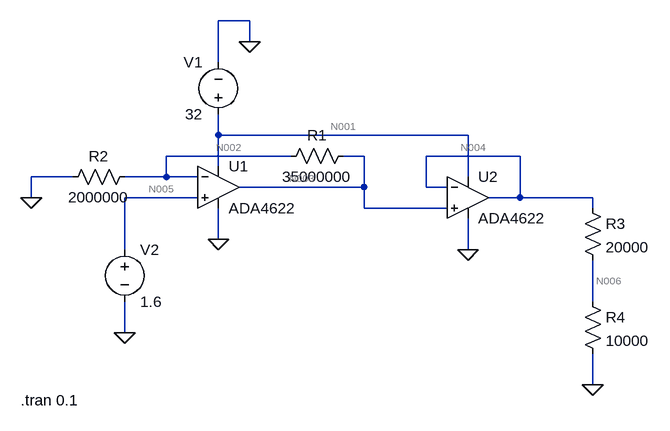
[diagram p0: schematic Ohmmeter_Circuit_1p0.asc]
Ohmmeter_Circuit_1p0.asc, the LTspice schematic file:
Version 4.1
SHEET 1 880 680
WIRE 192 -96 144 -96
WIRE 192 -64 192 -96
WIRE 144 -32 144 -96
WIRE 144 80 144 48
WIRE 528 80 144 80
WIRE 256 112 64 112
WIRE 368 112 336 112
WIRE 608 112 464 112
WIRE 144 128 144 80
WIRE -80 144 -144 144
WIRE 64 144 64 112
WIRE 64 144 0 144
WIRE 112 144 64 144
WIRE 528 144 528 80
WIRE 368 160 368 112
WIRE 368 160 176 160
WIRE 464 160 464 112
WIRE 496 160 464 160
WIRE -144 176 -144 144
WIRE 112 176 0 176
WIRE 608 176 608 112
WIRE 608 176 560 176
WIRE 720 176 608 176
WIRE 368 192 368 160
WIRE 496 192 368 192
WIRE 720 192 720 176
WIRE 144 240 144 192
WIRE 0 256 0 176
WIRE 528 256 528 208
WIRE 720 336 720 272
WIRE 0 384 0 336
WIRE 720 464 720 416
FLAG 144 240 0
FLAG 528 256 0
FLAG 192 -64 0
FLAG -144 176 0
FLAG 0 384 0
FLAG 720 464 0
SYMBOL OpAmps\\ADA4622 144 96 R0
SYMATTR InstName U1
SYMBOL OpAmps\\ADA4622 528 112 R0
SYMATTR InstName U2
SYMBOL voltage 144 64 R180
WINDOW 0 24 96 Left 2
WINDOW 3 24 16 Left 2
WINDOW 123 0 0 Left 0
WINDOW 39 0 0 Left 0
SYMATTR InstName V1
SYMATTR Value 32
SYMBOL res 352 96 R90
WINDOW 0 0 56 VBottom 2
WINDOW 3 32 56 VTop 2
SYMATTR InstName R1
SYMATTR Value 35000000
SYMATTR SpiceLine tol=10 pwr=0.1
SYMBOL res 16 128 R90
WINDOW 0 0 56 VBottom 2
WINDOW 3 32 56 VTop 2
SYMATTR InstName R2
SYMATTR Value 2000000
SYMATTR SpiceLine tol=0.1 pwr=0.1
SYMBOL voltage 0 240 R0
WINDOW 123 0 0 Left 0
WINDOW 39 0 0 Left 0
SYMATTR InstName V2
SYMATTR Value 1.6
SYMBOL res 704 176 R0
SYMATTR InstName R3
SYMATTR Value 20000
SYMATTR SpiceLine tol=0.1 pwr=0.1
SYMBOL res 704 320 R0
SYMATTR InstName R4
SYMATTR Value 10000
SYMATTR SpiceLine tol=0.1 pwr=0.1
TEXT -160 488 Left 2 !.tran 0.1

The netlist it stands for:
* Ohmmeter_Circuit_1p0.asc
X§U1 N005 N002 N001 0 N003 ADA4622  ; pins In+ In- V+ V- OUT
X§U2 N003 N004 N001 0 N004 ADA4622  ; pins In+ In- V+ V- OUT
V1 N001 0 32
R1 N003 N002 35000000 tol=10 pwr=0.1
R2 N002 0 2000000 tol=0.1 pwr=0.1
V2 N005 0 1.6
R3 N004 N006 20000 tol=0.1 pwr=0.1
R4 N006 0 10000 tol=0.1 pwr=0.1
.tran 0.1
.lib ADA4622.lib
.backanno
.end

* Results of the author's LTspice run, read from the files saved beside the schematic
* Operating Point, zero values left out:
*   V(n001) = 32 V
*   V(n002) = 1.6 V
*   V(n003) = 29.6 V
*   V(n004) = 29.6 V
*   V(n005) = 1.6 V
*   V(n006) = 9.867 V
*   I(R1) = 800 nA
*   I(R2) = 800 nA
*   I(R3) = 986.7 µA
*   I(R4) = 986.7 µA
*   I(V1) = -2.418 mA
*   Ix(u1:2) = -3.442 pA
*   Ix(u1:3) = 715.8 µA
*   Ix(u1:4) = -715.9 µA
*   Ix(u1:5) = -800 nA
*   Ix(u2:1) = 3.553 pA
*   Ix(u2:3) = 1.702 mA
*   Ix(u2:4) = -1.702 mA
*   Ix(u2:5) = -986.7 µA